# Altium schematic sheet Dust1_carrier_6.SchDoc
size A4; SheetNumber: 1; SheetTotal: 1
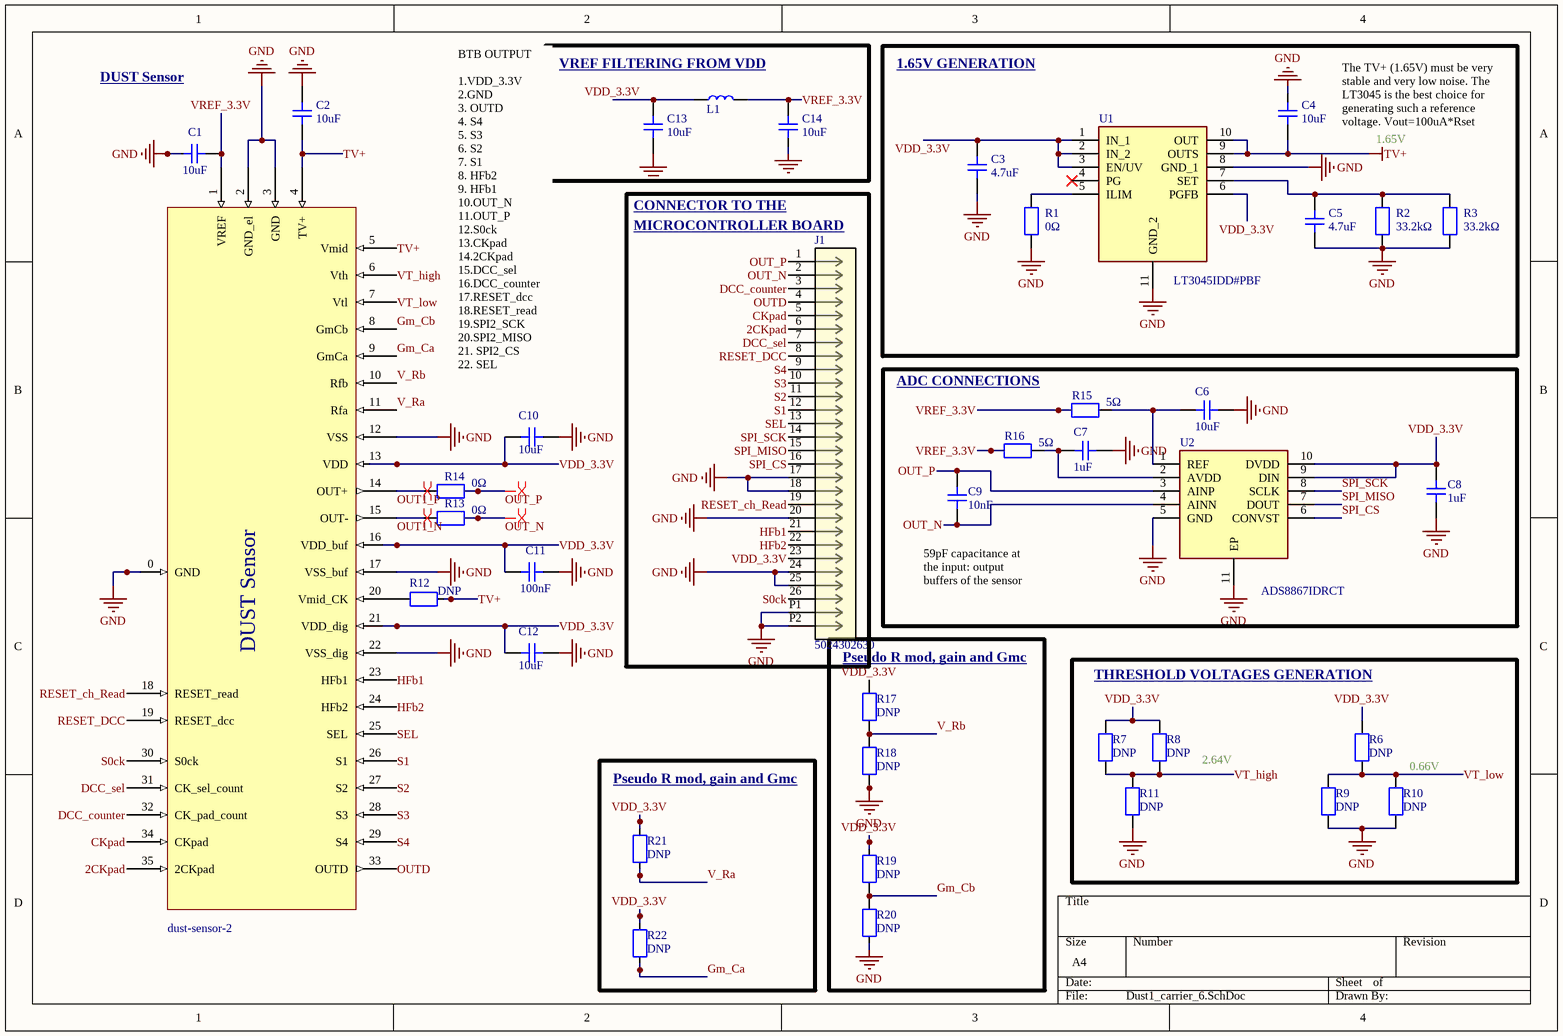
[diagram p0: Dust1_carrier_6.SchDoc]

## Parts
C1  10uF  [CAP_0402]
C2  10uF  [CAP_0402]
C3  4.7uF  [CAP_0402]
C4  10uF  [CAP_0402]
C5  4.7uF  [CAP_0402]
C6  10uF  [CAP_0402]
C7  1uF  [CAP_0402]
C8  1uF  [CAP_0402]
C9  10nF  [CAP_0402]
C10  10uF  [CAP_0402]
C11  100nF  [CAP_0402]
C12  10uF  [CAP_0402]
C13  10uF  [CAP_0402]
C14  10uF  [CAP_0402]
dust-sensor-2  dust-sensor-2  [dust-sensor-2-Footprint-1]
J1  5024302630  [CON_5024302630_MOL]
L1  IND_0603  [IND_0603]  (value not drawn)
R1  0Ω  [RES_0402]
R2  33.2kΩ  [RES_0402]
R3  33.2kΩ  [RES_0402]
R6  DNP  [RES_0402]
R7  DNP  [RES_0402]
R8  DNP  [RES_0402]
R9  DNP  [RES_0402]
R10  DNP  [RES_0402]
R11  DNP  [RES_0402]
R12  DNP  [RES_0402]
R13  0Ω  [RES_0402]
R14  0Ω  [RES_0402]
R15  5Ω  [RES_0402]
R16  5Ω  [RES_0402]
R17  DNP  [RES_0402]
R18  DNP  [RES_0402]
R19  DNP  [RES_0402]
R20  DNP  [RES_0402]
R21  DNP  [RES_0402]
R22  DNP  [RES_0402]
U1  LT3045IDD#PBF  [SON50P300X300X80-11N-D]
U2  ADS8867IDRCT  [SON50P300X300X100-11N-D]

## Blocks framed on the sheet
VREF FILTERING FROM VDD: C13 C14 L1
1.65V GENERATION: C3-C5 R1-R3 U1
ADC CONNECTIONS: C6-C9 R15 R16 U2
Pseudo R mod, gain and Gmc: R17-R20
THRESHOLD VOLTAGES GENERATION: R6-R11
Pseudo R mod, gain and Gmc: R21 R22

## Nets
GND: C1.2 C2.2 C3.1 C4.2 C5.1 C6.1 C7.1 C8.2 C10.1 C11.1 C12.1 C13.1 C14.1 dust-sensor-2.0(GND) dust-sensor-2.2(GND_el) dust-sensor-2.3(GND) dust-sensor-2.12(VSS) dust-sensor-2.17(VSS_buf) dust-sensor-2.22(VSS_dig) J1.17 J1.18 J1.20 J1.24 J1.25 J1.P1 J1.P2 R1.1 R2.1 R3.1 R9.1 R10.1 R11.1 R18.1 R20.1 U1.8(GND_1) U1.11(GND_2) U2.5(GND) U2.11(EP)
TV+: C2.1 C4.1 dust-sensor-2.4(TV+) dust-sensor-2.5(Vmid) R12.1 U1.9(OUTS) U1.10(OUT)
2CKpad: dust-sensor-2.35(2CKpad) J1.6
CKpad: dust-sensor-2.34(CKpad) J1.5
DCC_counter: dust-sensor-2.32(CK_pad_count) J1.3
DCC_sel: dust-sensor-2.31(CK_sel_count) J1.7
Gm_Ca: dust-sensor-2.9(GmCa) R22.1
Gm_Cb: dust-sensor-2.8(GmCb) R19.1 R20.2
HFb1: dust-sensor-2.23(HFb1) J1.21
HFb2: dust-sensor-2.24(HFb2) J1.22
OUT1_N: dust-sensor-2.15(OUT-) R13.2
OUT1_P: dust-sensor-2.14(OUT+) R14.2
OUT_N: C9.2 J1.2 R13.1 U2.4(AINN)
OUT_P: C9.1 J1.1 R14.1 U2.3(AINP)
OUTD: dust-sensor-2.33(OUTD) J1.4
RESET_ch_Read: dust-sensor-2.18(RESET_read) J1.19
RESET_DCC: dust-sensor-2.19(RESET_dcc) J1.8
S0ck: dust-sensor-2.30(S0ck) J1.26
S1: dust-sensor-2.26(S1) J1.12
S2: dust-sensor-2.27(S2) J1.11
S3: dust-sensor-2.28(S3) J1.10
S4: dust-sensor-2.29(S4) J1.9
SEL: dust-sensor-2.25(SEL) J1.13
SPI_CS: J1.16 U2.6(CONVST)
SPI_MISO: J1.15 U2.7(DOUT)
SPI_SCK: J1.14 U2.8(SCLK)
V_Ra: dust-sensor-2.11(Rfa) R21.1
V_Rb: dust-sensor-2.10(Rfb) R17.1 R18.2
VDD_3.3V: C3.2 C8.1 C10.2 C11.2 C12.2 C13.2 dust-sensor-2.13(VDD) dust-sensor-2.16(VDD_buf) dust-sensor-2.21(VDD_dig) J1.23 L1.1 R6.2 R7.2 R8.2 R17.2 R19.2 R21.2 R22.2 U1.1(IN_1) U1.2(IN_2) U1.3(EN/UV) U1.6(PGFB) U2.9(DIN) U2.10(DVDD)
VREF_3.3V: C1.1 C14.2 dust-sensor-2.1(VREF) L1.2 R15.2 R16.2
VT_high: dust-sensor-2.6(Vth) R7.1 R8.1 R11.2
VT_low: dust-sensor-2.7(Vtl) R6.1 R9.2 R10.2
NetC5_2: C5.2 R2.2 R3.2 U1.7(SET)
NetC6_2: C6.2 R15.1 U2.1(REF)
NetC7_2: C7.2 R16.1 U2.2(AVDD)
Netdust-sensor-2_20: dust-sensor-2.20(Vmid_CK) R12.2
NetR1_2: R1.2 U1.5(ILIM)

Not connected (* = marked no-connect by the designer): U1 4(PG)*

## Layout directives
differential pair: OUT1_N, OUT1_P, OUT_N, OUT_P

## Notes on the sheet
- DUST Sensor
- The TV+ (1.65V) must be very stable and very low noise. The LT3045 is the best choice for generating such a reference voltage. Vout=100uA*Rset
- 1.65V
- CONNECTOR TO THE
- (near J1) MICROCONTROLLER BOARD
- BTB OUTPUT
  1.VDD_3.3V
  2.GND
  3. OUTD
  4. S4
  5. S3
  6. S2
  7. S1
  8. HFb2
  9. HFb1
  10.OUT_N
  11.OUT_P
  12.S0ck
  13.CKpad
  14.2CKpad
  15.DCC_sel
  16.DCC_counter
  17.RESET_dcc
  18.RESET_read
  19.SPI2_SCK
  20.SPI2_MISO
  21. SPI2_CS
  22. SEL
- (near C9) 59pF capacitance at the input: output buffers of the sensor might be unstable
- (near R8) 2.64V
- (near R10) 0.66V
- (in symbol CMP-010-00025-11) DUST Sensor

## Library data of the parts
C1-C14 = CMP-001-00099-1: Design Item ID: CAP_0402; Source: CAP_0402.SchLib
dust-sensor-2 = CMP-010-00025-11: dust-sensor-v2-2025
J1 = CMP-097-000000-5: SlimStack Board-to-Board Plug, 0.40mm Pitch, Surface Mount, Dual Row, Vertical Stacking, 1.00mm Stacking Height, with Solder Tabs, with Vacuum  Tape, 26 Circuits; Manufacturer_Name: Molex Connector Corporation; Design Item ID: 5024302630; Copyright: Copyright (C) 2025 Ultra Librarian. All rights reserved.; Manufacturer_Part_Number: 5024302630; Type: Type; Source: 5024302630.SchLib; RefDes: RefDes
L1 = CMP-006-00026-1: Generic 0603 Inductor; Source: IND_0603.SchLib; Design Item ID: IND_0603
R1-R3 R6-R22 = CMP-009-00192-1: Resistor SMD 0402 Generic; Design Item ID: RES_0402; Source: RES_0402.SchLib
U1 = CMP-111-000001-2: Linear Technology LT3045IDD#PBF, LDO Regulator, 500mA Adjustable, 0  15 V, +/-1% 10-Pin, DFN; Manufacturer_Name: Analog Devices; Geometry.Height: 0.8mm; Manufacturer_Part_Number: LT3045IDD#PBF; Source: LT3045IDD#PBF.SchLib; Datasheet Link: https://www.analog.com/media/en/technical-documentation/data-sheets/3045fa.pdf; Arrow Part Number: LT3045IDD#PBF; Mouser Part Number: 584-LT3045IDD#PBF; Arrow Price/Stock: https://www.arrow.com/en/products/lt3045iddpbf/analog-devices?utm_currency=USD&region=nac; Design Item ID: LT3045IDD#PBF; Mouser Price/Stock: https://www.mouser.co.uk/ProductDetail/Analog-Devices/LT3045IDDPBF?qs=oahfZPh6IAL0HQTYgxXgGA%3D%3D
U2 = CMP-00018-2: 16-Bit, 100-kSPS, Serial Interface, microPower, Miniature, Truly-Differential Input, SAR ADC; Manufacturer_Name: Texas Instruments; Geometry.Height: 1mm; Datasheet Link: http://www.ti.com/lit/gpn/ADS8867; Mouser Price/Stock: https://www.mouser.co.uk/ProductDetail/Texas-Instruments/ADS8867IDRCT?qs=P6JsaOY39iimBkK0NU%2FcVg%3D%3D; Mouser Part Number: 595-ADS8867IDRCT; Manufacturer_Part_Number: ADS8867IDRCT; Source: ADS8867IDRCT.SchLib; Design Item ID: ADS8867IDRCT